# Altium schematic sheet misc_rf.SchDoc
size A4
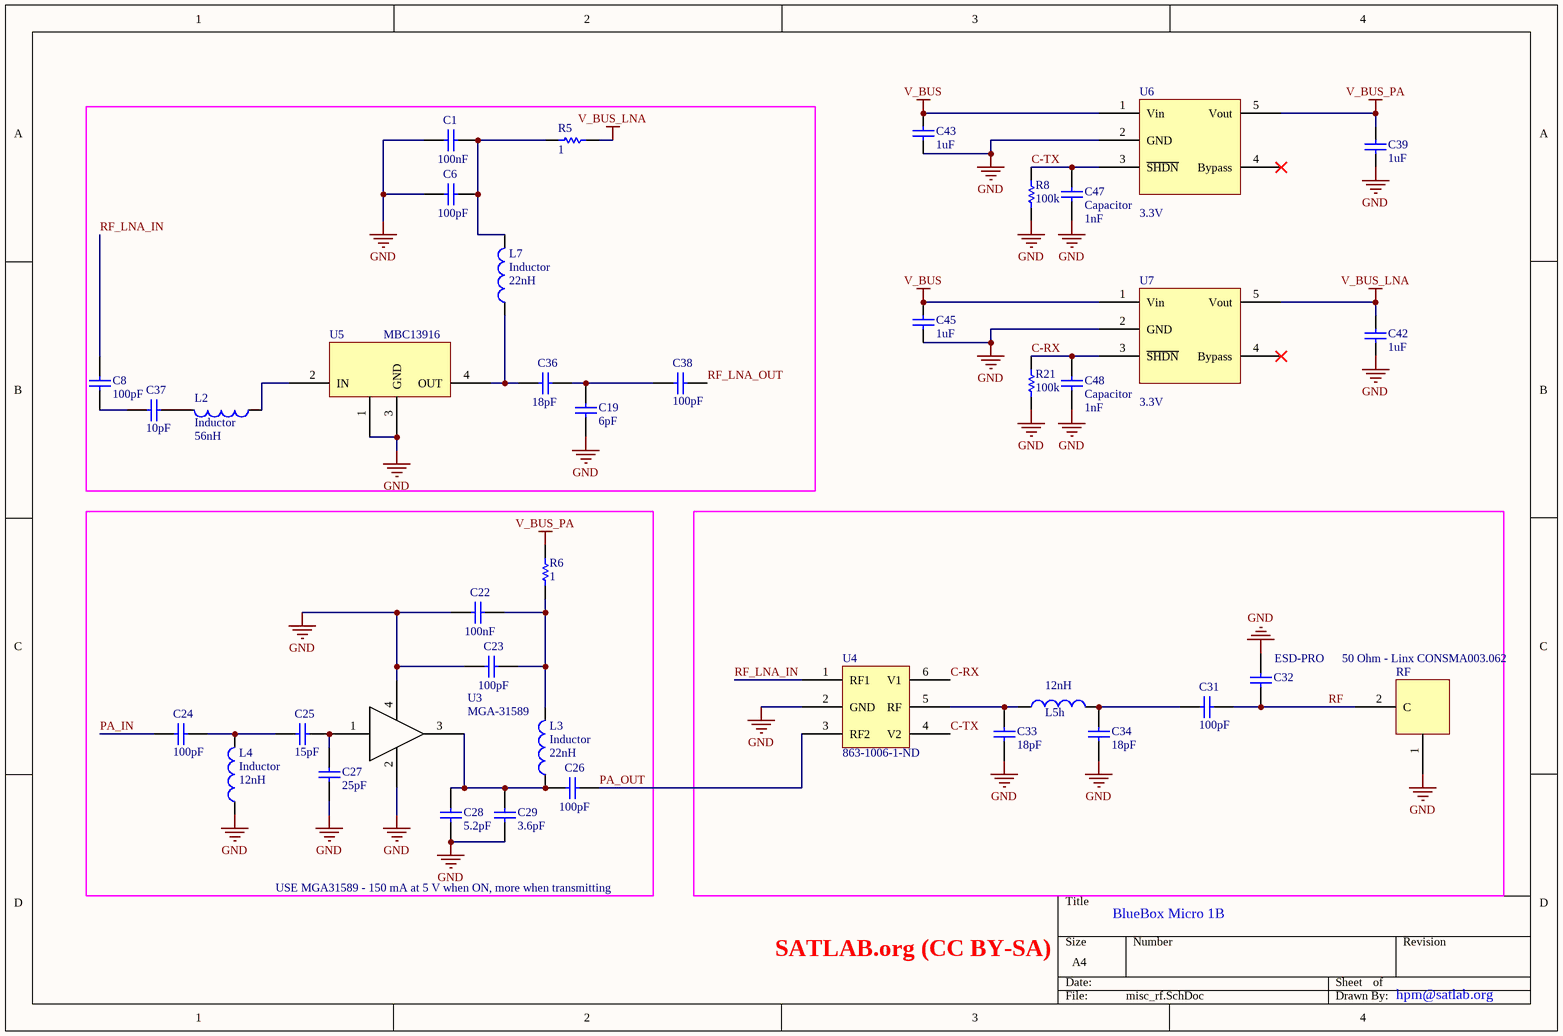
[diagram p0: misc_rf.SchDoc]

## Parts
C1  value 100nF  [C06]  (hidden comment: Cap Semi)
C6  value 100pF  [C06]  (hidden comment: Cap Semi)
C8  value 100pF  [C06]  (hidden comment: Cap Semi)
C19  value 6pF  [C06]  (hidden comment: Cap Semi)
C22  value 100nF  [C06]  (hidden comment: Cap Semi)
C23  value 100pF  [C06]  (hidden comment: Cap Semi)
C24  value 100pF  [C06]  (hidden comment: Cap Semi)
C25  value 15pF  [C06]  (hidden comment: Cap Semi)
C26  value 100pF  [C06]  (hidden comment: Cap Semi)
C27  value 25pF  [C06]  (hidden comment: Cap Semi)
C28  value 5.2pF  [C06]  (hidden comment: Cap Semi)
C29  value 3.6pF  [C06]  (hidden comment: Cap Semi)
C31  value 100pF  [C06]  (hidden comment: Capacitor)
C32  value ESD-PRO  [C06]  (hidden comment: Capacitor)
C33  value 18pF  [C06]  (hidden comment: Cap Semi)
C34  value 18pF  [C06]  (hidden comment: Cap Semi)
C36  value 18pF  [C06]  (hidden comment: Cap Semi)
C37  value 10pF  [C06]  (hidden comment: Cap Semi)
C38  value 100pF  [C06]  (hidden comment: Cap Semi)
C39  value 1uF  [C06]  (hidden comment: Capacitor)
C42  value 1uF  [C06]  (hidden comment: Capacitor)
C43  value 1uF  [C06]  (hidden comment: Capacitor)
C45  value 1uF  [C06]  (hidden comment: Capacitor)
C47  Capacitor  value 1nF  [C06]
C48  Capacitor  value 1nF  [C06]
L2  Inductor  value 56nH  [C06]
L3  Inductor  value 22nH  [C06]
L4  Inductor  value 12nH  [C06]
L5h  value 12nH  [C06]  (hidden comment: Inductor)
L7  Inductor  value 22nH  [C06]
R5  value 1  [R06]  (hidden comment: Resistor)
R6  value 1  [R06]  (hidden comment: Resistor)
R8  value 100k  [R06]  (hidden comment: Resistor)
R21  value 100k  [R06]  (hidden comment: Resistor)
RF  50 Ohm - Linx CONSMA003.062  [sma-egde]
U3  MGA-31589  [SOT-223B-small]
U4  Supplier Part Number 1: 863-1006-1-ND  [SOT95P280X145-6N]  (hidden comment: AS193-73)
U5  MBC13916  [MBC13916]
U6  Voltage: 3.3V  [SOT23]
U7  Voltage: 3.3V  [SOT23]

## Blocks framed on the sheet
USE MGA31589 - 150 mA at 5 V when ON, more when transmitting: C22-C29 L3 L4 R6 U3

## Nets
GND: C1.2 C6.2 C19.2 C22.2 C23.2 C27.1 C28.2 C29.2 C32.1 C33.2 C34.2 C39.1 C42.1 C43.1 C45.1 C47.2 C48.2 L4.1 R8.1 R21.1 RF.1(GND) U3.2(GND) U3.4(GND) U4.2(GND) U5.1(GND) U5.3(GND) U6.2(GND) U7.2(GND)
V_BUS: C43.2 C45.2 U6.1(Vin) U7.1(Vin)
V_BUS_LNA: C42.2 R5.2 U7.5(Vout)
V_BUS_PA: C39.2 R6.2 U6.5(Vout)
C-RX: C48.1 R21.2 U4.6(V1) U7.3(~{SHDN})
C-TX: C47.1 R8.2 U4.4(V2) U6.3(~{SHDN})
PA_IN: C24.1
PA_OUT: C26.1 U4.3(RF2)
RF: C31.1 C32.2 RF.2(C)
RF_LNA_IN: C8.1 U4.1(RF1)
RF_LNA_OUT: C38.2
NetC1_1: C1.1 C6.1 L7.2 R5.1
NetC8_2: C8.2 C37.1
NetC19_1: C19.1 C36.1 C38.1
NetC22_1: C22.1 C23.1 L3.2 R6.1
NetC24_2: C24.2 C25.1 L4.2
NetC25_2: C25.2 C27.2 U3.1(RF_IN)
NetC26_2: C26.2 C28.1 C29.1 L3.1 U3.3(RF_OUT)
NetC31_2: C31.2 C34.1 L5h.2
NetC33_1: C33.1 L5h.1 U4.5(RF)
NetC36_2: C36.2 L7.1 U5.4(OUT)
NetC37_2: C37.2 L2.2
NetL2_1: L2.1 U5.2(IN)

Not connected (* = marked no-connect by the designer): U6 4(Bypass)*; U7 4(Bypass)*

## Notes on the sheet
- BlueBox Micro 1B
- SATLAB.org (CC BY-SA)
- hpm@satlab.org

## Library data of the parts
C1 C6 C8 C19 C22-C29 C33 C34 C36-C38 = Cap Semi: Capacitor (Semiconductor SIM Model); Published: 8-Jun-2000; LatestRevisionDate: 17-Jul-2002; LatestRevisionNote: Re-released for DXP Platform.; PackageReference: C1206; Publisher: Altium Limited
C31 C32 C39 C42 C43 C45 C47 C48 = Capacitor: Capacitor, standard
R5 R6 R8 R21 = Resistor: By: Troels Jessen; Username: tjessen
RF = SMA_BOARD_EGDE: Linx CONSMA003.062  -  SMA Female Edge Mount for 1.6 mm PCB
U3 = MGA-31589: 0.5 W High Gain Driver Amplifier
U4 = AS193-73: PHEMT GaAs IC High-Linearity 3 V  Control SPDT Switch 0.1–2.5 GHz; By: HP; Datasheet: http://www.skyworksinc.com/uploads/documents/200186C.pdf; DigiKey: 863-1006-1-ND; Supplier 1: Digi-Key
U6 U7 = TC1185: Voltage regulater from Microchip
L2-L4 L5h L7 = Inductor: Published: 07-04-2008; LatestRevisionNote: Aalborg University; PackageReference: 0402-A; Publisher: <HP>; Digikey: 495-2017-1-ND